# EAGLE design r10_328_1284 (EAGLE 8.2.1)
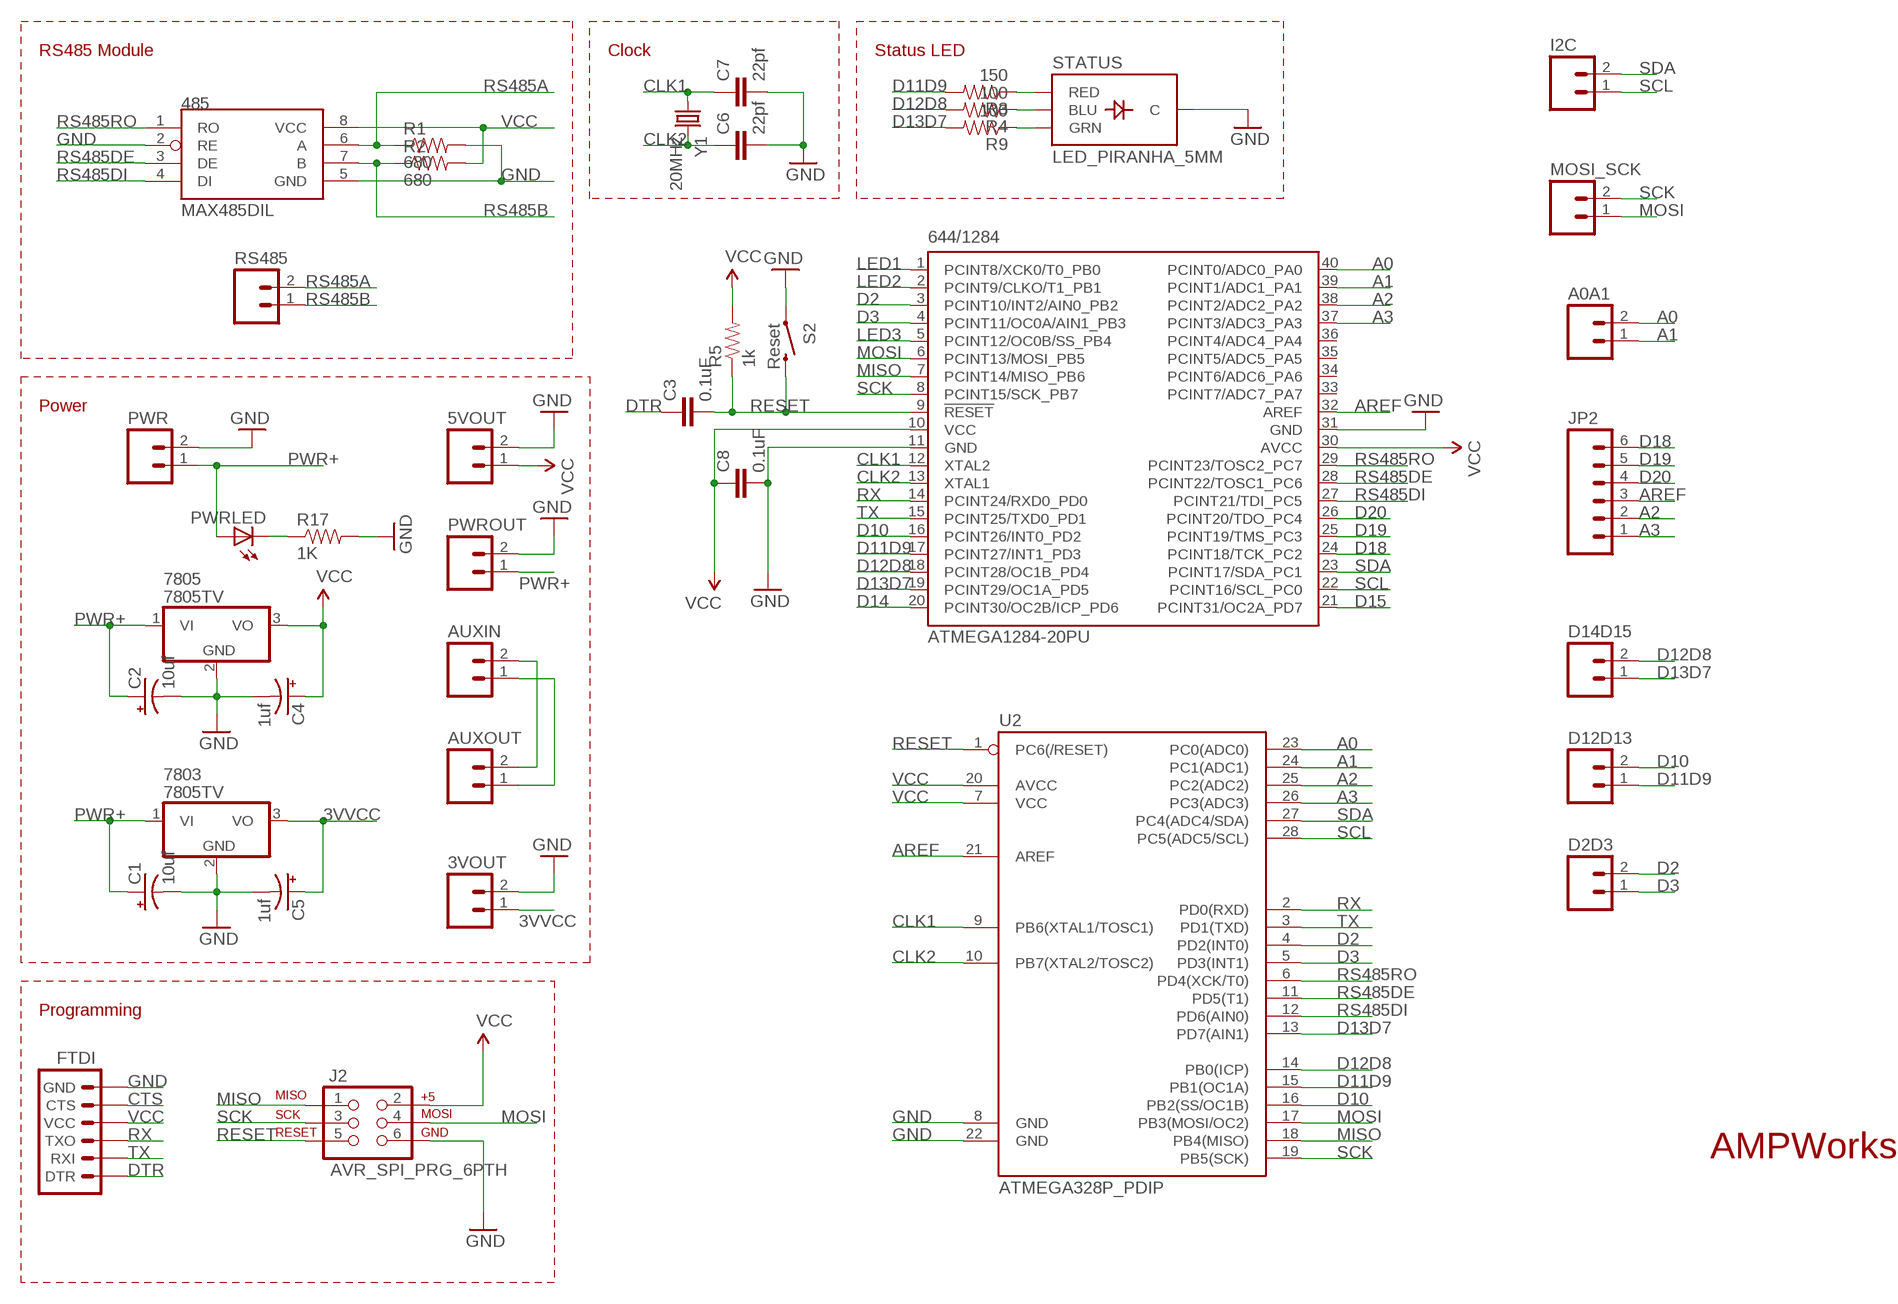
[diagram p0: schematic, sheet 1]

## Parts
3VOUT  M025MM  [SCREWTERMINAL-5MM-2]
5VOUT  M025MM  [SCREWTERMINAL-5MM-2]
485  MAX485DIL  [DIL08]
644/1284  ATMEGA1284-20PU  ATMEGA644-20PU  [DIL40]
7803  7805TV  [TO220V]
7805  7805TV  [TO220V]
A0A1  M025MM  [SCREWTERMINAL-5MM-2]
AUXIN  M025MM  [SCREWTERMINAL-5MM-2]
AUXOUT  M025MM  [SCREWTERMINAL-5MM-2]
C1  10uf  CAP_POLPTH2  [CPOL-RADIAL-10UF-25V]
C2  10uf  CAP_POLPTH2  [CPOL-RADIAL-10UF-25V]
C3  0.1uF  CAPPTH  [CAP-PTH-SMALL]
C4  1uf  CAP_POLPTH2  [CPOL-RADIAL-10UF-25V]
C5  1uf  CAP_POLPTH2  [CPOL-RADIAL-10UF-25V]
C6  22pf  CAPPTH  [CAP-PTH-SMALL]
C7  22pf  CAPPTH  [CAP-PTH-SMALL]
C8  0.1uF  CAPPTH  [CAP-PTH-SMALL]
D2D3  M025MM  [SCREWTERMINAL-5MM-2]
D12D13  M025MM  [SCREWTERMINAL-5MM-2]
D14D15  M025MM  [SCREWTERMINAL-5MM-2]
FTDI  ARDUINO_SERIAL_PROGRAMPTH  [1X06]
I2C  M025MM  [SCREWTERMINAL-5MM-2]
J2  AVR_SPI_PRG_6PTH  [2X3]
JP2  M06NO_SILK  [1X06_NO_SILK]
MOSI_SCK  M025MM  [SCREWTERMINAL-5MM-2]
PWR  M025MM  [SCREWTERMINAL-5MM-2]
PWRLED  LED5MM  [LED5MM]
PWROUT  M025MM  [SCREWTERMINAL-5MM-2]
R1  680  RESISTORPTH-1/4W  [AXIAL-0.4]
R2  680  RESISTORPTH-1/4W  [AXIAL-0.4]
R3  150  RESISTORPTH-1/4W  [AXIAL-0.4]
R4  100  RESISTORPTH-1/4W  [AXIAL-0.4]
R5  1k  RESISTORPTH-1/4W  [AXIAL-0.4]
R9  100  RESISTORPTH-1/4W  [AXIAL-0.4]
R17  1K  RESISTORPTH-1/4W  [AXIAL-0.4]
RS485  M025MM  [SCREWTERMINAL-5MM-2]
S2  Reset  SWITCH-MOMENTARY-2SMD  [TACTILE_SWITCH_SMD]
STATUS  LED_PIRANHA_5MM  [LED_PIRANHA_5MM]
U2  ATMEGA328P_PDIP  [DIL28-3]
Y1  20MHz  CRYSTALHC49US  [HC49US]

## Nets
3VVCC: 3VOUT.1 7803.3(VO) C5.1(+)
A0: 644/1284.40(PCINT0/ADC0_PA0) A0A1.2 U2.23(PC0(ADC0))
A1: 644/1284.39(PCINT1/ADC1_PA1) A0A1.1 U2.24(PC1(ADC1))
A2: 644/1284.38(PCINT2/ADC2_PA2) JP2.2 U2.25(PC2(ADC2))
A3: 644/1284.37(PCINT3/ADC3_PA3) JP2.1 U2.26(PC3(ADC3))
AREF: 644/1284.32(AREF) JP2.3 U2.21(AREF)
CLK1: 644/1284.12(XTAL2) C7.1 U2.9(PB6(XTAL1/TOSC1)) Y1.1
CLK2: 644/1284.13(XTAL1) C6.1 U2.10(PB7(XTAL2/TOSC2)) Y1.2
CTS: FTDI.CTS
D2: 644/1284.3(PCINT10/INT2/AIN0_PB2) D2D3.2 U2.4(PD2(INT0))
D3: 644/1284.4(PCINT11/OC0A/AIN1_PB3) D2D3.1 U2.5(PD3(INT1))
D10: 644/1284.16(PCINT26/INT0_PD2) D12D13.2 U2.16(PB2(SS/OC1B))
D11D9: 644/1284.17(PCINT27/INT1_PD3) D12D13.1 R3.P$2 U2.15(PB1(OC1A))
D12D8: 644/1284.18(PCINT28/OC1B_PD4) D14D15.2 R4.P$2 U2.14(PB0(ICP))
D13D7: 644/1284.19(PCINT29/OC1A_PD5) D14D15.1 R9.P$2 U2.13(PD7(AIN1))
D14: 644/1284.20(PCINT30/OC2B/ICP_PD6)
D15: 644/1284.21(PCINT31/OC2A_PD7)
D18: 644/1284.24(PCINT18/TCK_PC2) JP2.6
D19: 644/1284.25(PCINT19/TMS_PC3) JP2.5
D20: 644/1284.26(PCINT20/TDO_PC4) JP2.4
DTR: C3.1 FTDI.DTR
GND: 3VOUT.2 5VOUT.2 485.2(RE) 485.5(GND) 644/1284.11(GND) 644/1284.31(GND) 7803.2(GND) 7805.2(GND) C1.2(-) C2.2(-) C4.2(-) C5.2(-) C6.2 C7.2 C8.2 FTDI.GND J2.6 PWR.2 PWROUT.2 R1.P$2 R17.P$2 S2.1 STATUS.-(C) U2.8(GND) U2.22(GND)
LED1: 644/1284.1(PCINT8/XCK0/T0_PB0)
LED2: 644/1284.2(PCINT9/CLKO/T1_PB1)
LED3: 644/1284.5(PCINT12/OC0B/SS_PB4)
MISO: 644/1284.7(PCINT14/MISO_PB6) J2.1 U2.18(PB4(MISO))
MOSI: 644/1284.6(PCINT13/MOSI_PB5) J2.4 MOSI_SCK.1 U2.17(PB3(MOSI/OC2))
N$1: PWRLED.K(C) R17.P$1
N$2: AUXIN.1 AUXOUT.1
N$3: AUXIN.2 AUXOUT.2
N$5: R3.P$1 STATUS.R(RED)
N$6: R4.P$1 STATUS.B(BLU)
N$7: R9.P$1 STATUS.G(GRN)
PWR+: 7803.1(VI) 7805.1(VI) C1.1(+) C2.1(+) PWR.1 PWRLED.A PWROUT.1
RESET: 644/1284.9(!RESET) C3.2 J2.5 R5.P$1 S2.3 U2.1(PC6(/RESET))
RS485A: 485.6(A) R1.P$1 RS485.2
RS485B: 485.7(B) R2.P$1 RS485.1
RS485DE: 485.3(DE) 644/1284.28(PCINT22/TOSC1_PC6) U2.11(PD5(T1))
RS485DI: 485.4(DI) 644/1284.27(PCINT21/TDI_PC5) U2.12(PD6(AIN0))
RS485RO: 485.1(RO) 644/1284.29(PCINT23/TOSC2_PC7) U2.6(PD4(XCK/T0))
RX: 644/1284.14(PCINT24/RXD0_PD0) FTDI.TXO U2.2(PD0(RXD))
SCK: 644/1284.8(PCINT15/SCK_PB7) J2.3 MOSI_SCK.2 U2.19(PB5(SCK))
SCL: 644/1284.22(PCINT16/SCL_PC0) I2C.1 U2.28(PC5(ADC5/SCL))
SDA: 644/1284.23(PCINT17/SDA_PC1) I2C.2 U2.27(PC4(ADC4/SDA))
TX: 644/1284.15(PCINT25/TXD0_PD1) FTDI.RXI U2.3(PD1(TXD))
VCC: 5VOUT.1 485.8(VCC) 644/1284.10(VCC) 644/1284.30(AVCC) 7805.3(VO) C4.1(+) C8.1 FTDI.VCC J2.2 R2.P$2 R5.P$2 U2.7(VCC) U2.20(AVCC)
Unconnected: 644/1284.33(PCINT7/ADC7_PA7) 644/1284.34(PCINT6/ADC6_PA6) 644/1284.35(PCINT5/ADC5_PA5) 644/1284.36(PCINT4/ADC4_PA4)

## Notes on the sheet
- RS485 Module | Clock | Status LED
- Power
- Programming
- AMPWorks

## Library data of the parts
3VOUT 5VOUT A0A1 AUXIN AUXOUT D2D3 D12D13 D14D15 I2C MOSI_SCK PWR PWROUT RS485 = SparkFun-Connectors:M02: Standard 2-pin 0.1" header. Use with - straight break away headers ( PRT-00116) - right angle break away headers (PRT-00553) - swiss pins (PRT-00743) - machine pins (PRT-00117) - female headers (PRT-00115) Molex polarized connector foot print use with: PRT-08233 with associated crimp pins and housings. 2.54_SCREWTERM for use with PRT-10571. 3.5mm Screw Terminal footprints for PRT-08084 5mm Screw Terminal footprints for use with PRT-08432; STOREFRONT_ID: PRT-08432
485 = SparkFun-DigitalIC:MAX485: RS-485 transceiver
644/1284 = atmel:ATMEGA644-*PU: 8-bit Microcontroller with 64K Bytes In-System Programmable Flash Auto generated by make-symbol-device-package-bsdl.ulp Rev. 34 Source: http://www.atmel.com/dyn/resources/prod_documents/doc2593.pdf; MPN: ATMEGA644-20PU; OC_FARNELL: 1288340; OC_NEWARK: 23M5060
7803 7805 = linear:78*: Positive VOLTAGE REGULATOR Source: http://cache.national.com/ds/LM/LM78L05.pdf http://www.fairchildsemi.com/ds/LM/LM7805.pdf
C1 C2 C4 C5 = SparkFun-Capacitors:CAP_POL: Capacitor Polarized These are standard SMD and PTH capacitors. Normally 10uF, 47uF, and 100uF in electrolytic and tantalum varieties. Always verify the external diameter of the through hole cap, it varies with capacity, voltage, and manufacturer. The EIA devices should be standard.
C3 C6-C8 = SparkFun-Capacitors:CAP: Capacitor Standard 0603 ceramic capacitor, and 0.1" leaded capacitor.
FTDI = SparkFun-Connectors:ARDUINO_SERIAL_PROGRAM: FTDI connector footprints
J2 = SparkFun-Connectors:AVR_SPI_PRG_6: AVR ISP 6 Pin This is the reduced ISP connector for AVR programming. Common on Arduino. This footprint will take up less PCB space and can be used with a 10-pin to 6-pin adapter such as SKU: BOB-08508
JP2 = SparkFun-Connectors:M06: Header 6 Standard 6-pin 0.1" header. Use with straight break away headers (SKU : PRT-00116), right angle break away headers (PRT-00553), swiss pins (PRT-00743), machine pins (PRT-00117), and female headers (PRT-00115). Molex polarized connector foot print use with SKU : PRT-08094 with associated crimp pins and housings. NOTES ON THE VARIANTS LOCK and LOCK_LONGPADS... This footprint was designed to help hold the alignment of a through-hole component (i.e. 6-pin header) while soldering it into place. You may notice that each hole has been shifted either up or down by 0.005 of an inch from it's more standard position (which is a perfectly straight line). This slight alteration caused the pins (the squares in the middle) to touch the edges of the holes. Because they are alternating, it causes a "brace" to hold the component in place. 0.005 has proven to be the perfect amount of "off-center" position when using our standard breakaway headers. Although looks a little odd when you look at the bare footprint, once you have a header in there, the alteration is very hard to notice. Also,if you push a header all the way into place, it is covered up entirely on the bottom side. This idea of altering the position of holes to aid alignment will be further integrated into the Sparkfun Library for other footprints. It can help hold any component with 3 or more connection pins.
PWRLED = SparkFun-LED:LED: LEDs Standard schematic elements and footprints for 5mm, 3mm, 1206, and 0603 sized LEDs. 5mm - Spark Fun Electronics SKU : COM-00529 (and others)
R1 R2 R17 = SparkFun-Resistors:RESISTOR: Resistor Basic schematic elements and footprints for 0603, 1206, and PTH resistors.
R3-R5 R9 = SparkFun-Passives:RESISTOR: Resistor Basic schematic elements and footprints for 0603, 1206, and PTH resistors.
S2 = SparkFun:SWITCH-MOMENTARY-2
STATUS = SparkFun-LED:LED_PIRANHA_5MM: High-brightness RGB through-hole LED, similar to that used in the Shiftbrite
U2 = SparkFun-DigitalIC:ATMEGA328P_PDIP: uC used in the Arduino 32kb flash, 1k EEPROM, 2k SRAM This is the through-hole version of this chip.
Y1 = SparkFun-FreqCtrl:CRYSTAL: Various standard crystals. Proven footprints. Spark Fun Electronics SKU : COM-00534

## Net classes
0 default: width 0.203 mm

## Board
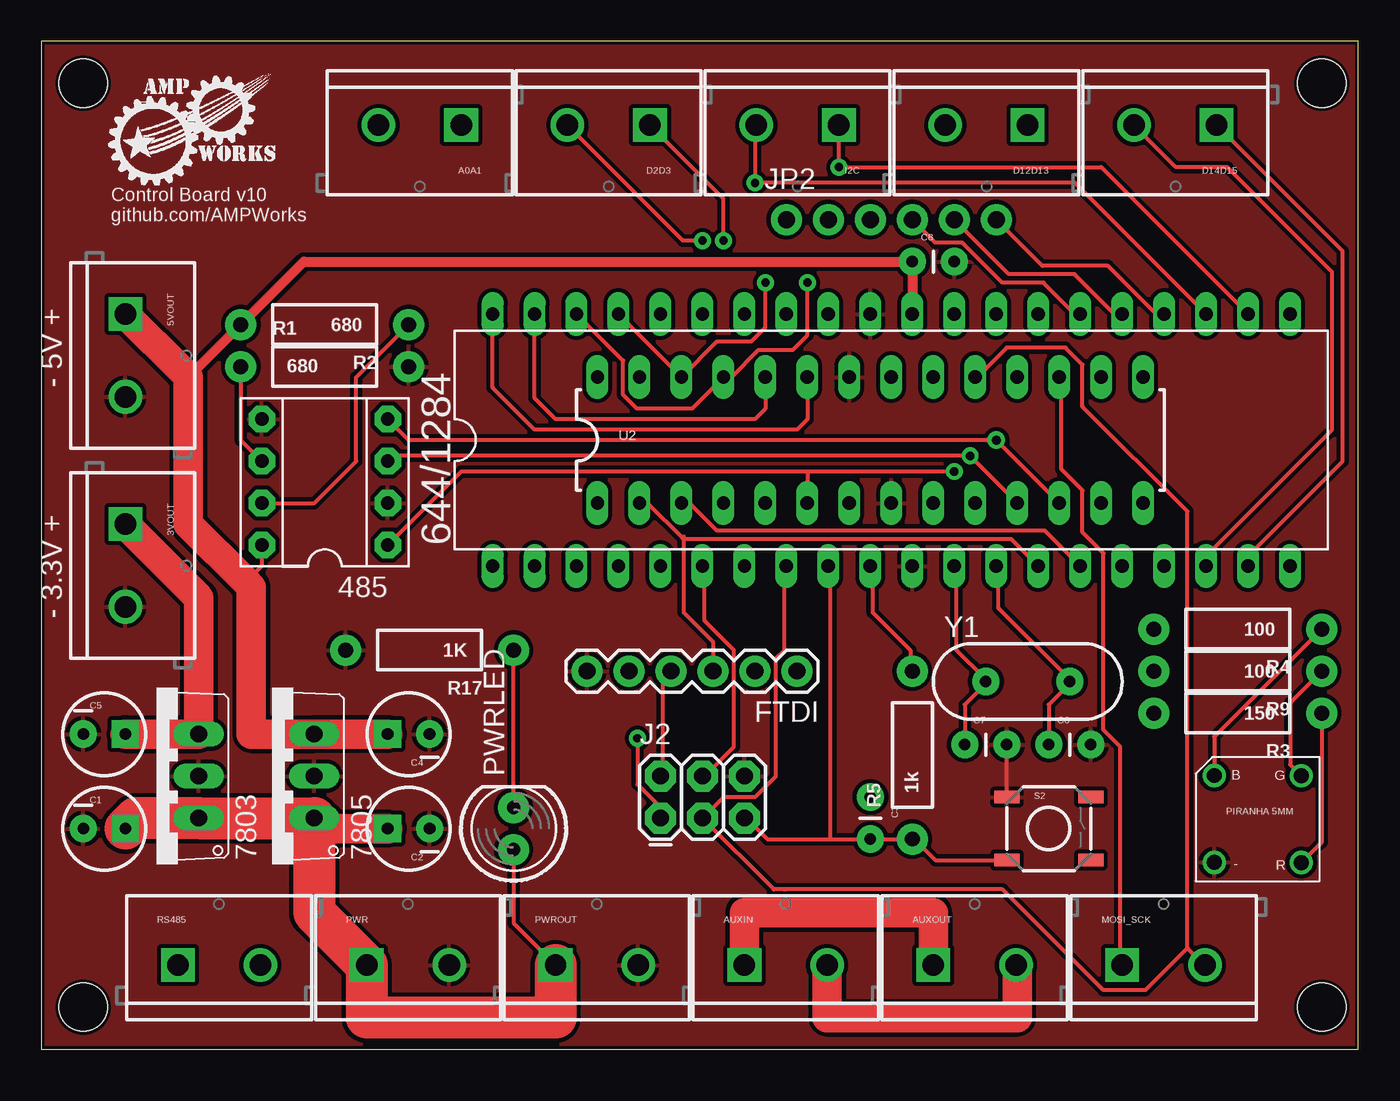
[diagram p1: board, top side]
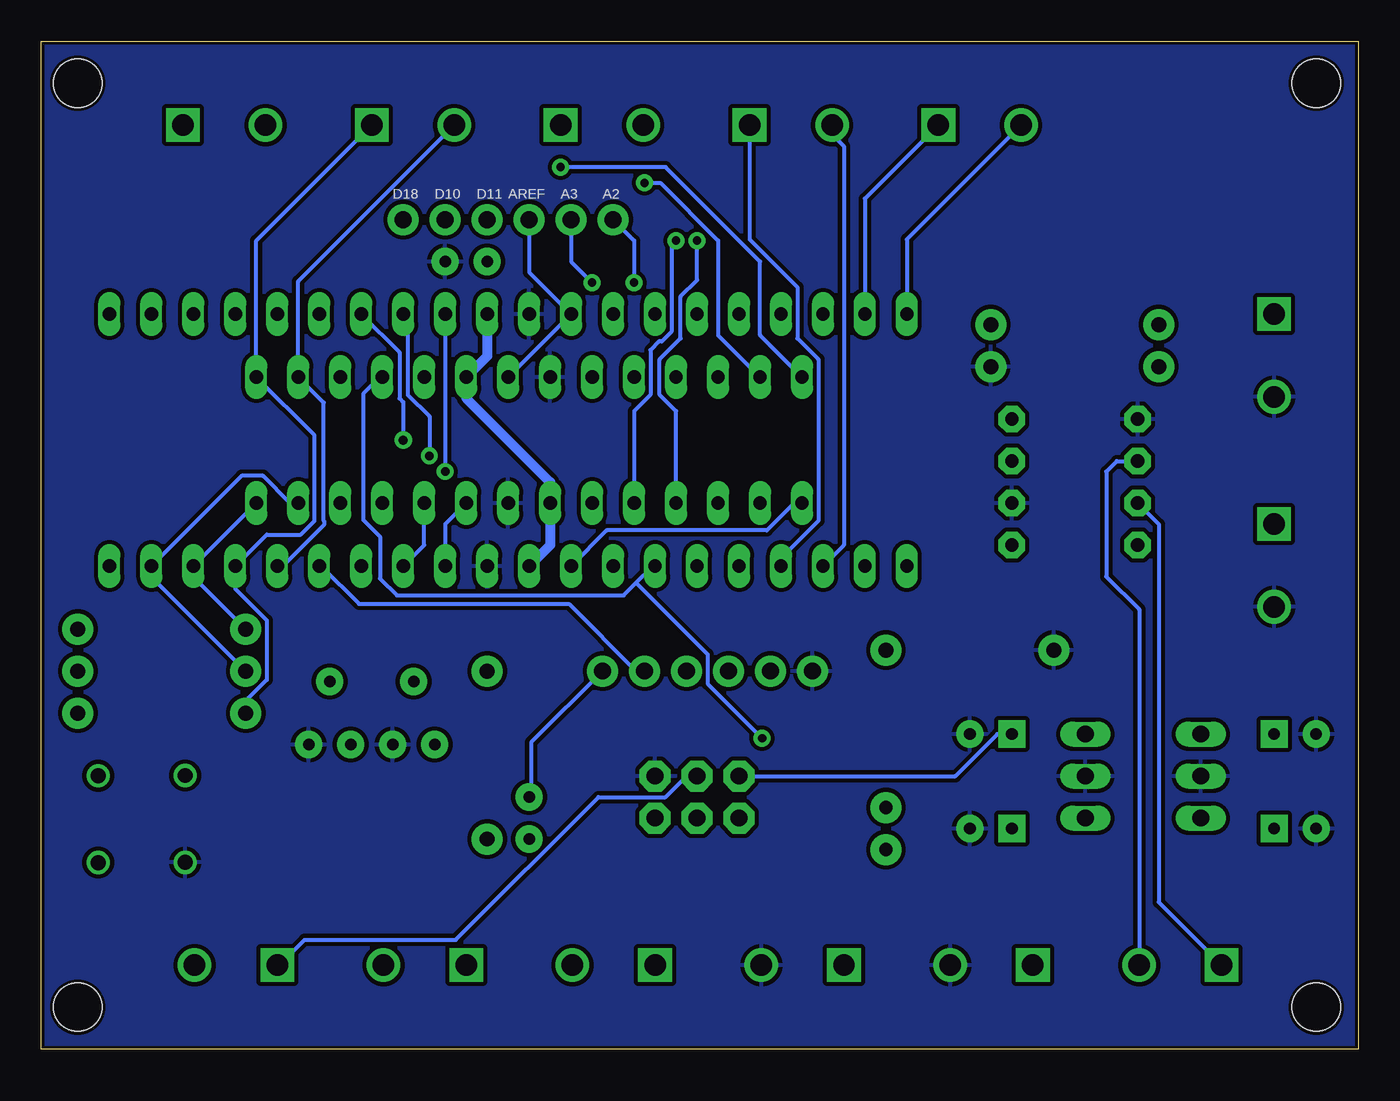
[diagram p2: board, bottom side, seen from below]

Size 79.68 x 60.95 mm. Coordinates in mm from the lower left corner, seen from the top.
Outline: 0,0 79.68,0 79.68,60.95 0,60.95 0,0
Copper layers (1*16): Top 0.035mm / dielectric 1.5mm / Bottom 0.035mm
Design rules "SparkFun-2-layer-STANDARD": minimum track width 10mil, minimum drill 20mil, track to track 10mil, track to pad 8mil, pad to pad 8mil, via to via 10mil, smd to smd 8mil, copper to edge 8mil, drill to drill 8mil, minimum pad ring 10mil, minimum via ring 10mil, stop-mask expansion 4mil, vias tented up to drill 25mil, thermal gap 10mil
Holes 2.92 mm at 2.54,58.42 77.47,58.42 77.47,2.54 2.54,2.54

### Footprints (pad centres in the part's own frame; a part is rotated, then mirrored left to right if it is on the bottom)
SCREWTERMINAL-5MM-2 = drill 1.3 pad 2.032 square: 1 0,0 | drill 1.3 pad 2.032: 2 5,0
DIL08 = drill 0.813 pad 1.6 octagon: 1 -3.81,-3.81; 2 -1.27,-3.81; 3 1.27,-3.81; 4 3.81,-3.81; 5 3.81,3.81; 6 1.27,3.81; 7 -1.27,3.81; 8 -3.81,3.81
DIL40 = drill 0.813 long: 1 -24.13,-7.62; 2 -21.59,-7.62; 3 -19.05,-7.62; 4 -16.51,-7.62; 5 -13.97,-7.62; 6 -11.43,-7.62; 7 -8.89,-7.62; 8 -6.35,-7.62; 9 -3.81,-7.62; 10 -1.27,-7.62; 11 1.27,-7.62; 12 3.81,-7.62; 13 6.35,-7.62; 14 8.89,-7.62; 15 11.43,-7.62; 16 13.97,-7.62; 17 16.51,-7.62; 18 19.05,-7.62; 19 21.59,-7.62; 20 24.13,-7.62; 21 24.13,7.62; 22 21.59,7.62; 23 19.05,7.62; 24 16.51,7.62; 25 13.97,7.62; 26 11.43,7.62; 27 8.89,7.62; 28 6.35,7.62; 29 3.81,7.62; 30 1.27,7.62; 31 -1.27,7.62; 32 -3.81,7.62; 33 -6.35,7.62; 34 -8.89,7.62; 35 -11.43,7.62; 36 -13.97,7.62; 37 -16.51,7.62; 38 -19.05,7.62; 39 -21.59,7.62; 40 -24.13,7.62
TO220V = drill 1.016 long: 1 -2.54,-2.54; 2 0,-2.54; 3 2.54,-2.54
CPOL-RADIAL-10UF-25V = drill 0.7 pad 1.651 square: 1 1.27,0 | drill 0.7 pad 1.651: 2 -1.27,0
CAP-PTH-SMALL = drill 0.7 pad 1.651: 1 0,0; 2 2.54,0
1X06 = drill 1.016 pad 1.88: CTS 10.16,0; DTR 0,0; GND 12.7,0; RXI 2.54,0; TXO 5.08,0; VCC 7.62,0
2X3 = drill 1.016 pad 1.88 octagon: 1 0,0; 2 0,2.54; 3 2.54,0; 4 2.54,2.54; 5 5.08,0; 6 5.08,2.54
1X06_NO_SILK = drill 1.016 pad 1.88: 1 0,0; 2 2.54,0; 3 5.08,0; 4 7.62,0; 5 10.16,0; 6 12.7,0
LED5MM = drill 0.813 pad 1.88: A -1.27,0; K 1.27,0
AXIAL-0.4 = drill 0.9 pad 1.88: P$1 -5.08,0; P$2 5.08,0
TACTILE_SWITCH_SMD = smd 1.524 x 0.762: 1 -2.54,1.905; 2 2.54,1.905; 3 -2.54,-1.905; 4 2.54,-1.905
LED_PIRANHA_5MM = drill 0.9: - -2.684,-2.684; B -2.688,2.574; G 2.575,2.562; R 2.579,-2.696
DIL28-3 = drill 0.813 long: 1 -16.51,-3.81; 2 -13.97,-3.81; 3 -11.43,-3.81; 4 -8.89,-3.81; 5 -6.35,-3.81; 6 -3.81,-3.81; 7 -1.27,-3.81; 8 1.27,-3.81; 9 3.81,-3.81; 10 6.35,-3.81; 11 8.89,-3.81; 12 11.43,-3.81; 13 13.97,-3.81; 14 16.51,-3.81; 15 16.51,3.81; 16 13.97,3.81; 17 11.43,3.81; 18 8.89,3.81; 19 6.35,3.81; 20 3.81,3.81; 21 1.27,3.81; 22 -1.27,3.81; 23 -3.81,3.81; 24 -6.35,3.81; 25 -8.89,3.81; 26 -11.43,3.81; 27 -13.97,3.81; 28 -16.51,3.81
HC49US = drill 0.7 pad 1.651: 1 -2.54,0; 2 2.54,0

### Placement (x,y rotation side)
3VOUT  5.08,31.75 270 top
5VOUT  5.08,44.45 270 top
485  17.14,34.29 90 top
644/1284  51.44,36.83 0 top
7803  6.99,16.51 90 top
7805  13.97,16.51 90 top
A0A1  25.4,55.88 180 top
AUXIN  42.55,5.08 0 top
AUXOUT  53.98,5.08 0 top
C1  3.81,13.34 0 top
C2  22.23,13.34 180 top
C3  50.16,15.24 270 top
C4  22.23,19.05 180 top
C5  3.81,19.05 0 top
C6  60.96,18.41 0 top
C7  55.88,18.41 0 top
C8  52.7,47.62 0 top
D2D3  36.83,55.88 180 top
D12D13  59.69,55.88 180 top
D14D15  71.12,55.88 180 top
FTDI  45.72,22.86 180 top
I2C  48.26,55.88 180 top
J2  37.47,13.97 0 top
JP2  45.09,50.16 0 top
MOSI_SCK  65.41,5.08 0 top
PWR  19.68,5.08 0 top
PWRLED  28.57,13.34 90 top
PWROUT  31.11,5.08 0 top
R1  17.14,41.27 0 top
R2  17.14,43.81 180 top
R3  72.39,20.32 180 top
R4  72.39,25.4 180 top
R5  52.7,17.78 90 top
R9  72.39,22.86 180 top
R17  23.5,24.13 180 top
RS485  8.26,5.08 0 top
S2  60.96,13.34 0 top
STATUS  73.66,13.97 0 top
U2  50.16,36.83 0 top
Y1  59.69,22.23 0 top

### Tracks (layer width: path | path; a pad name or v marks a point on that pad's centre or on a via)
3VVCC
  Top 1.778: C5.1 7803.3 9.53,27.3 3VOUT.1
A0
  Top 0.254: U2.23 46.35,38.1 45.72,37.47 29.84,37.47 27.3,40.01 644/1284.40
  Bottom 0.254: A0A1.2 27.3,48.98 644/1284.40
A1
  Top 0.254: U2.24 43.81,38.73 43.18,38.1 31.11,38.1 29.84,39.37 644/1284.39
  Bottom 0.254: A0A1.1 29.84,51.44 644/1284.39
A2  (via drill 0.51)
  Top 0.254: 644/1284.38 35.2,41.63 35.2,39.57 36.04,38.73 39.37,38.73 U2.25 41.75,40.64 43.41,42.29 45.47,42.29 46.35,43.18 v46.35,46.35
  Bottom 0.254: JP2.2 47.62,47.62 v46.35,46.35
A3  (via drill 0.51)
  Top 0.254: 644/1284.37 U2.26 40.89,42.8 42.95,42.8 43.81,43.66 v43.81,46.35
  Bottom 0.254: JP2.1 43.81,48.9 v43.81,46.35
AREF
  Bottom 0.254: U2.21 644/1284.32 50.16,46.99 JP2.3
CLK1
  Top 0.254: C7.1 55.88,20.83 57.15,22.1 Y1.1 57.15,22.35 55.37,24.13 55.37,29.21 644/1284.12
  Bottom 0.254: U2.9 55.24,31.75 644/1284.12
CLK2
  Top 0.254: C6.1 60.96,20.83 62.23,22.1 Y1.2 62.23,22.35 57.91,26.67 57.91,29.21 644/1284.13
  Bottom 0.254: 644/1284.13 56.52,30.48 U2.10
D2  (via drill 0.51)
  Top 0.254: v40.01,48.9 38.81,48.9 D2D3.2
  Bottom 0.254: 644/1284.3 31.11,30.48 31.11,54.61 31.83,55.33 D2D3.2 | U2.4 41.27,38.58 42.27,39.57 42.27,41.71 41,42.98 41,45.52 40.01,46.51 v40.01,48.9
D3  (via drill 0.51)
  Top 0.254: v41.27,48.9 41.27,51.44 D2D3.1
  Bottom 0.254: D2D3.1 36.83,48.98 33.93,46.08 33.93,42.98 32.66,41.71 32.66,31.95 34.92,29.69 644/1284.4 | v41.27,48.9 41.55,48.62 41.55,43.38 42.13,42.8 42.29,42.8 42.82,42.27 42.82,39.57 43.81,38.58 U2.5
D10
  Bottom 0.254: D12D13.2 64.14,46.44 U2.16 62.59,39.09 62.59,31.95 62.55,31.91 62.55,31.75 65.09,29.21 644/1284.16
D11D9
  Bottom 0.254: D12D13.1 66.67,48.9 U2.15 63.14,37.11 63.14,31.95 63.98,31.11 66.04,31.11 644/1284.17 67.94,27.83 66.04,25.93 66.04,22.33 67.31,21.06 R3.P$2
D12D8
  Top 0.254: 644/1284.18 70.48,29.84 78.11,37.47 78.11,46.99 71.75,53.34 68.66,53.34 D14D15.2
  Bottom 0.254: U2.14 644/1284.18 70.48,28.57 R4.P$2
D13D7
  Top 0.254: 644/1284.19 73.03,29.84 78.74,35.56 78.74,48.26 D14D15.1
  Bottom 0.254: U2.13 64.61,33.02 66.27,34.67 67.56,34.67 644/1284.19 73.03,28.57 R9.P$2
D18
  Top 0.254: JP2.6 60.58,47.37 64.55,47.37 67.47,44.45 644/1284.24
D19
  Top 0.254: JP2.5 58.55,46.86 62.51,46.86 64.93,44.45 644/1284.25
D20
  Top 0.254: 644/1284.26 62.55,44.45 60.64,46.35 58.15,46.35 55.72,48.78 54.09,48.78 JP2.4
DTR
  Bottom 0.254: FTDI.DTR 50.04,18.54 50.04,15.24 C3.1
GND
  Top 0.254: S2.1 C7.2
  pour Bottom: 0,60.96 79.38,60.96 79.38,0 0,0
  pour Top: 0,0 80.01,0 80.01,60.96 0,60.96
MISO  (via drill 0.51)
  Top 0.254: v36.07,18.8 36.07,16 37.34,14.73 37.34,13.97 J2.1
  Bottom 0.254: 43.69,28.19 44.45,27.43 58.17,27.43 59.18,28.45 59.18,30.99 60.2,32 60.2,39.62 59.18,40.64 U2.18 | 43.69,28.19 42.67,29.21 644/1284.7 | v36.07,18.8 39.37,22.1 39.37,23.88 43.69,28.19
MOSI
  Top 0.254: 644/1284.6 40.13,29.21 40.13,25.91 41.91,24.13 41.91,18.29 40.13,16.51 J2.4 | U2.17 61.72,40.64 61.72,35.05 62.99,33.78 62.99,31.24 64.26,29.97 64.26,19.3 65.28,18.29 65.28,5.08 MOSI_SCK.1
  Bottom 0.254: J2.4 40.64,16.51 41.91,15.24 45.97,15.24 54.61,6.6 63.75,6.6 65.28,5.08 MOSI_SCK.1
N$1
  Top 0.254: PWRLED.K R17.P$1
N$2
  Top 1.778: AUXIN.1 42.55,8.26 53.98,8.26 AUXOUT.1
N$3
  Top 1.778: AUXIN.2 47.55,1.91 59.05,1.91 59.05,5.08 AUXOUT.2
N$5
  Top 0.254: R3.P$1 77.47,12.51 STATUS.R
N$6
  Top 0.254: R4.P$1 70.97,18.9 STATUS.B
N$7
  Top 0.254: R9.P$1 75.56,20.95 75.56,17.2 STATUS.G
PWR+
  Top 0.254: PWRLED.A 28.57,7.62 PWROUT.1
  Top 1.778: C2.1 17.14,13.34 7805.1
  Top 2.54: PWROUT.1 31.11,1.91 19.68,1.91 PWR.1 16.51,8.26 7805.1 7803.1 5.71,13.97 C1.1
RESET
  Top 0.254: S2.3 54.1,11.43 52.83,12.7 R5.P$1 C3.2 47.75,12.7 | 47.75,12.7 43.94,12.7 42.67,13.97 J2.5 | 47.75,12.7 47.75,29.21 644/1284.9
  Bottom 0.254: U2.1 34.13,33.02 35.78,31.37 45.47,31.37 644/1284.9
RS485A
  Top 0.254: R1.P$1 12.06,36.83 485.6
  Bottom 0.254: 485.6 14.61,35.56 15.24,34.92 15.24,28.57 13.26,26.59 RS485.2
RS485B
  Top 0.254: 485.7 16.51,33.02 19.05,35.56 19.05,40.64 R2.P$1
  Bottom 0.254: 485.7 12.06,31.75 12.06,8.89 RS485.1
RS485DE  (via drill 0.51)
  Top 0.254: U2.11 v56.2,35.88 21.59,35.88 21.27,35.56 485.3
  Bottom 0.254: v56.2,35.88 56.2,38.26 57.51,39.57 57.51,44.17 644/1284.28
RS485DI  (via drill 0.55)
  Top 0.254: U2.12 v57.78,36.83 22.23,36.83 485.4
  Bottom 0.254: 644/1284.27 58.01,42.14 58.01,39.36 57.78,39.13 v57.78,36.83
RS485RO  (via drill 0.51)
  Top 0.254: 46.35,34.92 U2.6 | 46.35,34.92 25.4,34.92 485.1 | v55.24,34.92 46.35,34.92
  Bottom 0.254: 644/1284.29 v55.24,34.92
RX
  Top 0.254: 644/1284.14 58.67,30.86 38.83,30.86 38.78,30.91 | U2.2 36.67,33.02 38.78,30.91 | FTDI.TXO 40.64,24.64 38.86,26.42 38.86,30.99 38.78,30.91
SCK
  Top 0.254: 644/1284.8 44.96,29.21 44.96,24.13 44.45,23.62 44.45,16.51 43.18,15.24 41.27,15.24 J2.3 44.32,9.65 45.09,9.65 | 69.34,6.1 69.34,32.51 62.99,38.86 62.99,41.4 61.98,42.42 58.42,42.42 56.64,40.64 U2.19 | 69.34,6.1 70.36,5.08 MOSI_SCK.2 | 45.09,9.65 58.17,9.65 64.26,3.56 66.8,3.56 69.34,6.1 | 45.09,9.65 44.96,9.65
SCL  (via drill 0.51)
  Top 0.254: 644/1284.22 64.14,53.34 v48.26,53.34 I2C.1
  Bottom 0.254: U2.28 36.2,43.18 36.2,47.62 41.91,53.34 v48.26,53.34
SDA  (via drill 0.51)
  Top 0.254: I2C.2 43.18,55.8 v43.18,52.39 62.55,52.39 644/1284.23
  Bottom 0.254: U2.27 38.73,43.18 38.73,48.9 42.23,52.39 v43.18,52.39
TX
  Top 0.254: U2.3 39.21,33.02 40.87,31.37 60.71,31.37 644/1284.15
  Bottom 0.254: FTDI.RXI 43.69,22.86 47.75,26.92 60.45,26.92 62.74,29.21 644/1284.15
VCC
  Top 0.254: 485.8 13.34,29.21 12.38,28.26 | R5.P$2 52.58,22.86 52.58,24.13 50.29,26.42 50.29,29.21 644/1284.10 | FTDI.VCC 37.59,22.35 37.59,16.51 J2.2
  Top 0.61: 644/1284.30 C8.1 15.88,47.62 R2.P$2 9.21,40.96 8.57,40.96
  Top 1.778: C4.1 7805.3 12.7,19.05 12.7,27.94 12.38,28.26 8.89,31.75 8.89,40.64 8.57,40.96 5VOUT.1
  Bottom 0.254: C4.1 21.84,19.05 24.38,16.51 J2.2
  Bottom 0.61: 644/1284.30 52.7,41.91 U2.20 53.98,39.37 48.9,34.29 U2.7 48.9,30.48 644/1284.10

### Text on the board
Top: Add lots of labels
tPlace: Control Board v10 | github.com/AMPWorks | - 5V + | - 3.3V +
bPlace: A2 | A3 | AREF | D11 | D10 | D18